# Altium schematic sheet MainBoard.SchDoc: Schéma global
size Letter; Organization: Robocup Ulaval; DocumentNumber: 1; Revision: 1.1; SheetNumber: 1; SheetTotal: 10; Version: Gamma 1.0; Conceptor: Philippe T. Simon B. Léonard G. Alexia B-L.
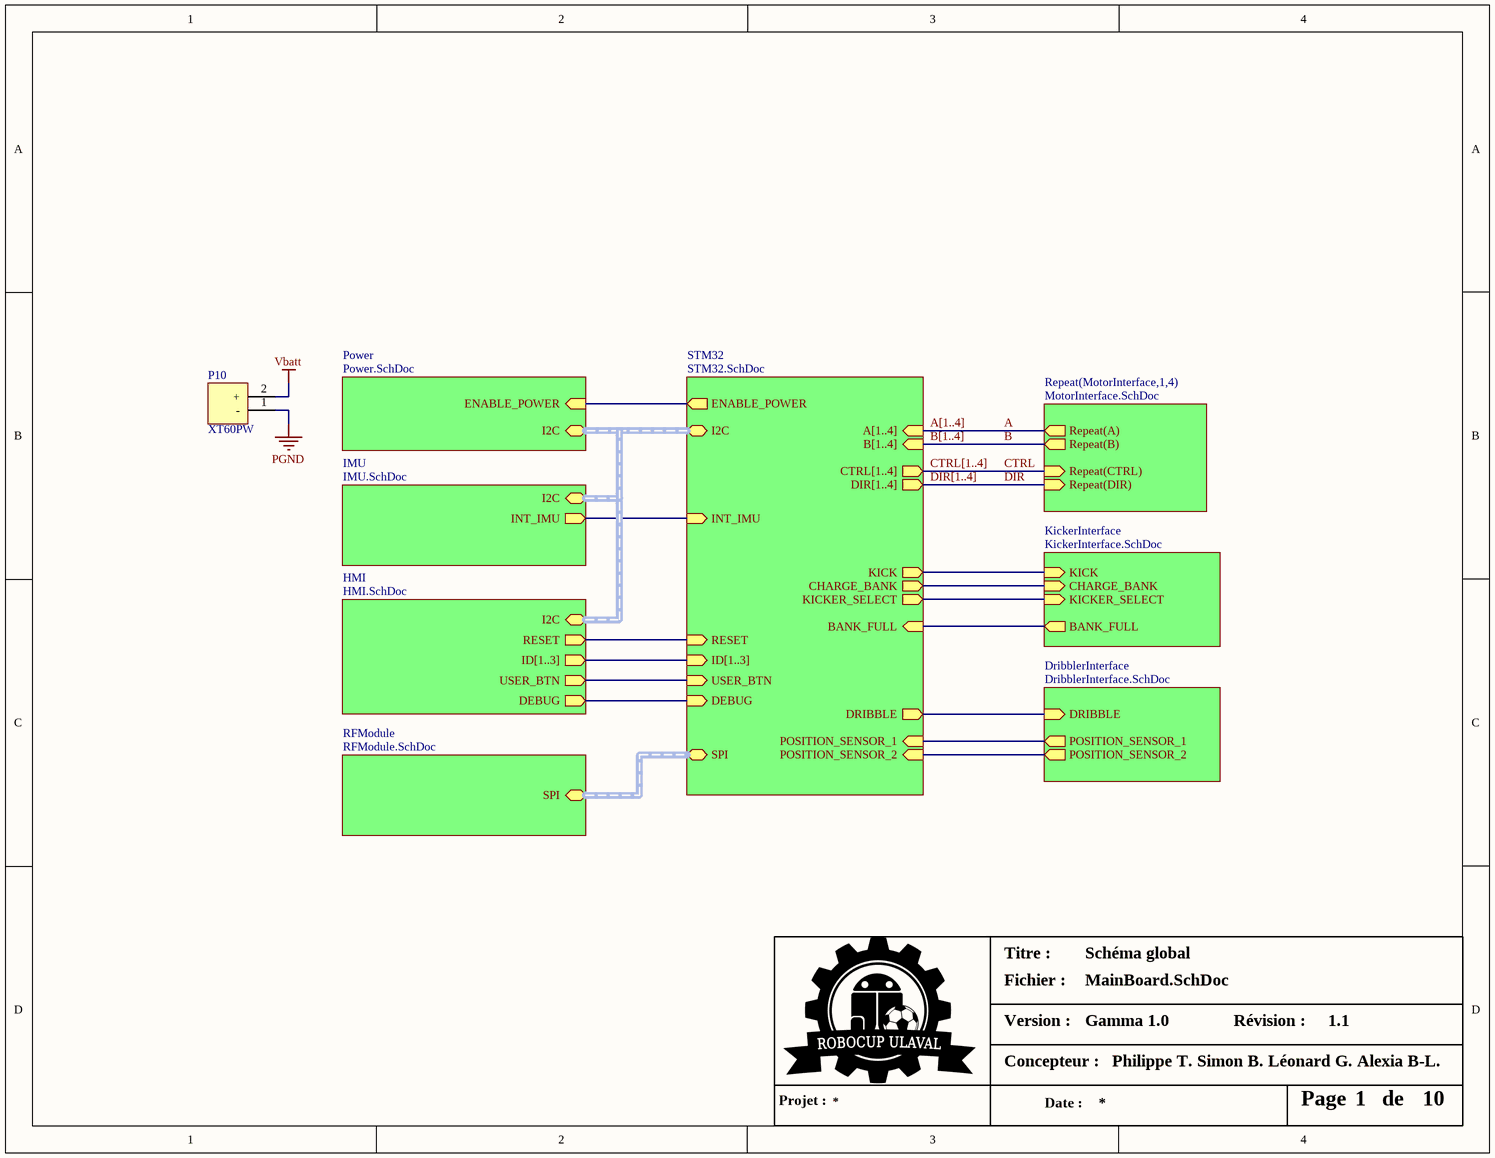
[diagram p0: MainBoard.SchDoc]

## Parts
P10  XT60PW  [XT60PW]

## Sub-sheets
DribblerInterface = DribblerInterface.SchDoc: DRIBBLE (in), POSITION_SENSOR_2 (out), POSITION_SENSOR_1 (out)
HMI = HMI.SchDoc: I2C (harness I2C), ID[1..3] (out), RESET (out), USER_BTN (out), DEBUG (out)
IMU = IMU.SchDoc: I2C (harness I2C), INT_IMU (out)
KickerInterface = KickerInterface.SchDoc: KICK (in), BANK_FULL (out), CHARGE_BANK (in), KICKER_SELECT (in)
Power = Power.SchDoc: ENABLE_POWER (in), I2C (harness I2C)
Repeat(MotorInterface,1,4) = MotorInterface.SchDoc: Repeat(A) (out), Repeat(B) (out), Repeat(CTRL) (in), Repeat(DIR) (in)
RFModule = RFModule.SchDoc: SPI (harness SPI)
STM32 = STM32.SchDoc: A[1..4] (in), B[1..4] (in), ID[1..3] (in), I2C (harness I2C), SPI (harness SPI), ENABLE_POWER (out), CTRL[1..4] (out), DIR[1..4] (out), KICK (out), BANK_FULL (in), CHARGE_BANK (out), POSITION_SENSOR_1 (in), POSITION_SENSOR_2 (in), DRIBBLE (out), RESET (in), INT_IMU (in), KICKER_SELECT (out), USER_BTN (in), DEBUG (in)

## Nets
PGND: P10.1(-)
Vbatt: P10.2(+)
A: sheet Repeat(MotorInterface,1,4)/Repeat(A)
B: sheet Repeat(MotorInterface,1,4)/Repeat(B)
CTRL: sheet Repeat(MotorInterface,1,4)/Repeat(CTRL)
DIR: sheet Repeat(MotorInterface,1,4)/Repeat(DIR)
(unnamed): sheet Power/ENABLE_POWER, sheet STM32/ENABLE_POWER
(unnamed): sheet KickerInterface/KICK, sheet STM32/KICK
(unnamed): sheet KickerInterface/BANK_FULL, sheet STM32/BANK_FULL
(unnamed): sheet KickerInterface/CHARGE_BANK, sheet STM32/CHARGE_BANK
(unnamed): sheet KickerInterface/KICKER_SELECT, sheet STM32/KICKER_SELECT
(unnamed): sheet DribblerInterface/DRIBBLE, sheet STM32/DRIBBLE
(unnamed): sheet DribblerInterface/POSITION_SENSOR_2, sheet STM32/POSITION_SENSOR_2
(unnamed): sheet DribblerInterface/POSITION_SENSOR_1, sheet STM32/POSITION_SENSOR_1
(unnamed): sheet HMI/RESET, sheet STM32/RESET
(unnamed): sheet HMI/USER_BTN, sheet STM32/USER_BTN
(unnamed): sheet HMI/DEBUG, sheet STM32/DEBUG
(unnamed): sheet IMU/INT_IMU, sheet STM32/INT_IMU

## Buses and harness runs
bus A[1..4] = sheet STM32/A[1..4]
bus B[1..4] = sheet STM32/B[1..4]
bus CTRL[1..4] = sheet STM32/CTRL[1..4]
bus DIR[1..4] = sheet STM32/DIR[1..4]
bus sheet HMI/ID[1..3] = sheet STM32/ID[1..3]
harness sheet HMI/I2C = sheet IMU/I2C = sheet Power/I2C = sheet STM32/I2C
harness sheet RFModule/SPI = sheet STM32/SPI

## Notes on the sheet
- Titre :
- Version :
- Fichier :
- Révision :
- Projet :
- Concepteur :
- Date :
- Page
- de

## Library data of the parts
P10 = XT60PW: XT60PW connector